# Altium schematic sheet DigitalComm.SchDoc: Digital Communications
size A; DocumentNumber: 4; SheetNumber: 4; SheetTotal: 9
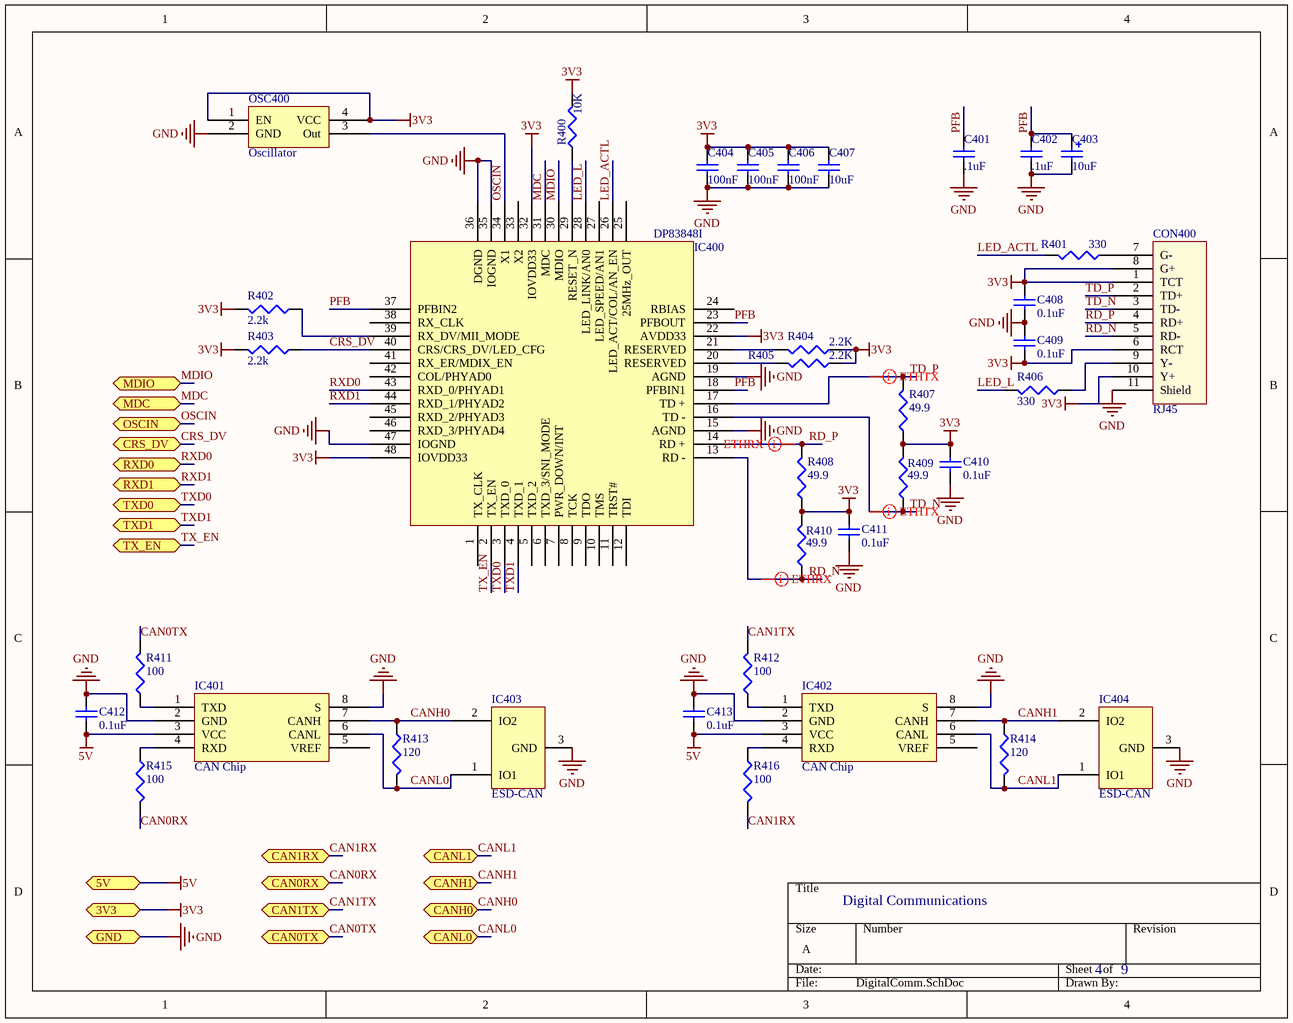
[diagram p0: DigitalComm.SchDoc]

## Parts
C401  value .1uF  [SMD0603]  (hidden comment: Capacitor Ceramic)
C402  value .1uF  [SMD0603]  (hidden comment: Capacitor Ceramic)
C403  value 10uF  [SMD1206 Polarized]  (hidden comment: Cap)
C404  value 100nF  [SMD0603]  (hidden comment: Capacitor Ceramic)
C405  value 100nF  [SMD0603]  (hidden comment: Capacitor Ceramic)
C406  value 100nF  [SMD0603]  (hidden comment: Capacitor Ceramic)
C407  value 10uF  [SMD0805]  (hidden comment: Capacitor Ceramic)
C408  value 0.1uF  [SMD0603]  (hidden comment: Cap)
C409  value 0.1uF  [SMD0603]  (hidden comment: Cap)
C410  value 0.1uF  [SMD0603]  (hidden comment: Cap)
C411  value 0.1uF  [SMD0603]  (hidden comment: Cap)
C412  value 0.1uF  [SMD0603]  (hidden comment: Capacitor Ceramic)
C413  value 0.1uF  [SMD0603]  (hidden comment: Capacitor Ceramic)
CON400  RJ45  [RJ45]
IC400  DP83848I  [LQFP-48]
IC401  CAN Chip  [SOIC-8]
IC402  CAN Chip  [SOIC-8]
IC403  ESD-CAN  [SOT-23-3]
IC404  ESD-CAN  [SOT-23-3]
OSC400  Oscillator  [SM77H-OSC]
R400  value 10K  [SMD0603]  (hidden comment: Res)
R401  value 330  [SMD0603]  (hidden comment: Res)
R402  value 2.2k  [SMD0603]  (hidden comment: Res)
R403  value 2.2k  [SMD0603]  (hidden comment: Res)
R404  value 2.2K  [SMD0603]  (hidden comment: Res)
R405  value 2.2K  [SMD0603]  (hidden comment: Res)
R406  value 330  [SMD0603]  (hidden comment: Res)
R407  value 49.9  [SMD0603]  (hidden comment: Res)
R408  value 49.9  [SMD0603]  (hidden comment: Res)
R409  value 49.9  [SMD0603]  (hidden comment: Res)
R410  value 49.9  [SMD0603]  (hidden comment: Res)
R411  value 100  [SMD0603]  (hidden comment: Res)
R412  value 100  [SMD0603]  (hidden comment: Res)
R413  value 120  [SMD0603]  (hidden comment: Res)
R414  value 120  [SMD0603]  (hidden comment: Res)
R415  value 100  [SMD0603]  (hidden comment: Res)
R416  value 100  [SMD0603]  (hidden comment: Res)

## Ports
3V3, 5V, CAN0RX, CAN0TX, CAN1RX, CAN1TX, CANH0, CANH1, CANL0, CANL1, CRS_DV, GND, MDC, MDIO, OSCIN, RXD0, RXD1, TX_EN, TXD0, TXD1

## Nets
3V3: C404.2 C405.2 C406.2 C407.2 C408.2 C409.1 C410.2 C411.2 CON400.1(TCT) CON400.6(RCT) CON400.8(G+) CON400.10(Y+) IC400.22(AVDD33) IC400.32(IOVDD33) IC400.48(IOVDD33) OSC400.1(EN) OSC400.4(VCC) R400.2 R402.2 R403.2 R404.1 R405.1 R407.1 R408.1 R409.2 R410.2 ; port 3V3
5V: C412.1 C413.1 IC401.3(VCC) IC402.3(VCC) ; port 5V
GND: C401.1 C402.1 C403.2 C404.1 C405.1 C406.1 C407.1 C408.1 C409.2 C410.1 C411.1 C412.2 C413.2 CON400.11(Shield) IC400.15(AGND) IC400.19(AGND) IC400.35(IOGND) IC400.36(DGND) IC400.47(IOGND) IC401.2(GND) IC401.8(S) IC402.2(GND) IC402.8(S) IC403.3(GND) IC404.3(GND) OSC400.2(GND) ; port GND
CAN0RX: R415.2 ; port CAN0RX
CAN0TX: R411.2 ; port CAN0TX
CAN1RX: R416.2 ; port CAN1RX
CAN1TX: R412.2 ; port CAN1TX
CANH0: IC401.7(CANH) IC403.2(IO2) R413.1 ; port CANH0
CANH1: IC402.7(CANH) IC404.2(IO2) R414.1 ; port CANH1
CANL0: IC401.6(CANL) IC403.1(IO1) R413.2 ; port CANL0
CANL1: IC402.6(CANL) IC404.1(IO1) R414.2 ; port CANL1
CRS_DV: IC400.40(CRS/CRS_DV/LED_CFG) R403.1 ; port CRS_DV
LED_ACTL: IC400.26(LED_ACT/COL/AN_EN) R401.2
LED_L: IC400.28(LED_LINK/AN0) R406.2
MDC: IC400.31(MDC) ; port MDC
MDIO: IC400.30(MDIO) ; port MDIO
OSCIN: IC400.34(X1) OSC400.3(Out) ; port OSCIN
PFB: C401.2 C402.2 C403.1 IC400.18(PFBIN1) IC400.23(PFBOUT) IC400.37(PFBIN2)
RD_N: CON400.5(RD-) IC400.13(RD_-) R410.1
RD_P: CON400.4(RD+) IC400.14(RD_+) R408.2
RXD0: IC400.43(RXD_0/PHYAD1) ; port RXD0
RXD1: IC400.44(RXD_1/PHYAD2) ; port RXD1
TD_N: CON400.3(TD-) IC400.16(TD_-) R409.1
TD_P: CON400.2(TD+) IC400.17(TD_+) R407.2
TX_EN: IC400.2(TX_EN) ; port TX_EN
TXD0: IC400.3(TXD_0) ; port TXD0
TXD1: IC400.4(TXD_1) ; port TXD1
NetCON400_7: CON400.7(G-) R401.1
NetCON400_9: CON400.9(Y-) R406.1
NetIC400_20: IC400.20(RESERVED) R405.2
NetIC400_21: IC400.21(RESERVED) R404.2
NetIC400_29: IC400.29(RESET_N) R400.1
NetIC400_39: IC400.39(RX_DV/MII_MODE) R402.1
NetIC401_1: IC401.1(TXD) R411.1
NetIC401_4: IC401.4(RXD) R415.1
NetIC402_1: IC402.1(TXD) R412.1
NetIC402_4: IC402.4(RXD) R416.1

Not connected (* = marked no-connect by the designer): IC400 1(TX_CLK) 5(TXD_2) 6(TXD_3/SNI_MODE) 7(PWR_DOWN/INT) 8(TCK) 9(TDO) 10(TMS) 11(TRST#) 12(TDI) 24(RBIAS) 25(25MHz_OUT) 27(LED_SPEED/AN1) 33(X2) 38(RX_CLK) 41(RX_ER/MDIX_EN) 42(COL/PHYAD0) 45(RXD_2/PHYAD3) 46(RXD_3/PHYAD4); IC401 5(VREF); IC402 5(VREF)

## Layout directives
differential pair: RD_N, RD_P, TD_N, TD_P

## Library data of the parts
C401 C402 C404-C413 = Capacitor Ceramic: Ceramic Chip Capacitor
C403 = Capacitor Polarized: Polarized Capacitor (Surface Mount)
CON400 = RJ45: RJ45 Ethernet Connector with built in magnetics; pin to pad: 11>S
IC400 = DP83848I: Ethernet PHY IC; compatitble with DP83848C
IC401 IC402 = SN65HVD1050
IC403 IC404 = ESDCAN24-2BLY
OSC400 = SM7745HEV: 50Mhz Oscillator
R400-R416 = Resistor